# Altium schematic sheet 20211009_EleksTube_IPS_V1.2.SchDoc
size A4
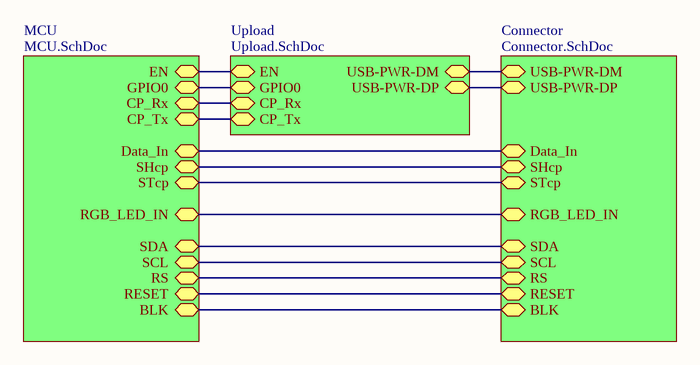
[diagram p0: 20211009_EleksTube_IPS_V1.2.SchDoc]

## Sub-sheets
Connector = Connector.SchDoc: USB-PWR-DM, USB-PWR-DP, SDA, SCL, RS, RESET, Data_In, SHcp, STcp, RGB_LED_IN, BLK
MCU = MCU.SchDoc: EN, GPIO0, CP_Rx, CP_Tx, Data_In, SHcp, STcp, SDA, SCL, RS, RESET, RGB_LED_IN, BLK
Upload = Upload.SchDoc: EN, GPIO0, USB-PWR-DM, USB-PWR-DP, CP_Rx, CP_Tx

## Nets
(unnamed): sheet MCU/EN, sheet Upload/EN
(unnamed): sheet MCU/GPIO0, sheet Upload/GPIO0
(unnamed): sheet MCU/CP_Rx, sheet Upload/CP_Rx
(unnamed): sheet MCU/CP_Tx, sheet Upload/CP_Tx
(unnamed): sheet MCU/Data_In, sheet Connector/Data_In
(unnamed): sheet MCU/SHcp, sheet Connector/SHcp
(unnamed): sheet MCU/STcp, sheet Connector/STcp
(unnamed): sheet MCU/SDA, sheet Connector/SDA
(unnamed): sheet MCU/SCL, sheet Connector/SCL
(unnamed): sheet MCU/RS, sheet Connector/RS
(unnamed): sheet MCU/RESET, sheet Connector/RESET
(unnamed): sheet MCU/RGB_LED_IN, sheet Connector/RGB_LED_IN
(unnamed): sheet MCU/BLK, sheet Connector/BLK
(unnamed): sheet Connector/USB-PWR-DM, sheet Upload/USB-PWR-DM
(unnamed): sheet Connector/USB-PWR-DP, sheet Upload/USB-PWR-DP